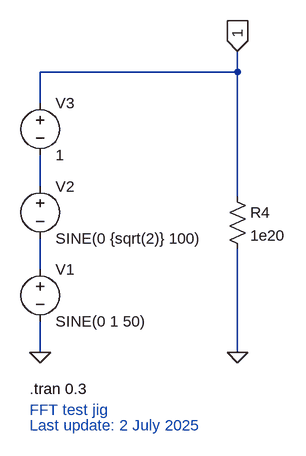
[diagram p0: schematic FFT Test jig.asc]
FFT Test jig.asc, the LTspice schematic file:
Version 4
SHEET 1 880 680
WIRE 80 -160 80 -192
WIRE 80 -160 -224 -160
WIRE -224 -112 -224 -160
WIRE -224 16 -224 -32
WIRE 80 32 80 -160
WIRE -224 144 -224 96
WIRE -224 272 -224 224
WIRE 80 272 80 112
FLAG -224 272 0
FLAG 80 272 0
FLAG 80 -192 1
IOPIN 80 -192 In
SYMBOL voltage -224 128 R0
WINDOW 123 0 0 Left 0
SYMATTR InstName V1
SYMATTR Value SINE(0 1 50)
SYMATTR SpiceLine Rser=0 Cpar=0
SYMBOL voltage -224 0 R0
WINDOW 123 0 0 Left 0
SYMATTR InstName V2
SYMATTR Value SINE(0 {sqrt(2)} 100)
SYMATTR SpiceLine Rser=0 Cpar=0
SYMBOL voltage -224 -128 R0
WINDOW 123 0 0 Left 0
WINDOW 39 0 0 Left 0
SYMATTR InstName V3
SYMATTR Value 1
SYMBOL res 64 16 R0
SYMATTR InstName R4
SYMATTR Value 1e20
TEXT -240 328 Left 2 !.tran 0.3
TEXT -240 384 Left 2 ;Last update: 2 July 2025
TEXT -240 360 Left 2 ;FFT test jig

The netlist it stands for:
* FFT Test jig.asc
V1 N002 0 SINE(0 1 50) Rser=0 Cpar=0
V2 N001 N002 SINE(0 {sqrt(2)} 100) Rser=0 Cpar=0
V3 1 N001 1
R4 1 0 1e20
.tran 0.3
* Last update: 2 July 2025
* FFT test jig
.backanno
.end